# EasyEDA schematic schematic.easyeda.json
TITLE: Lunatic MIDI: Organ Registers/Pistons Hub interface; REV: 1.0; Date: 2019-05-01; Sheet: 1/1; Drawn By: Marco Sacchi
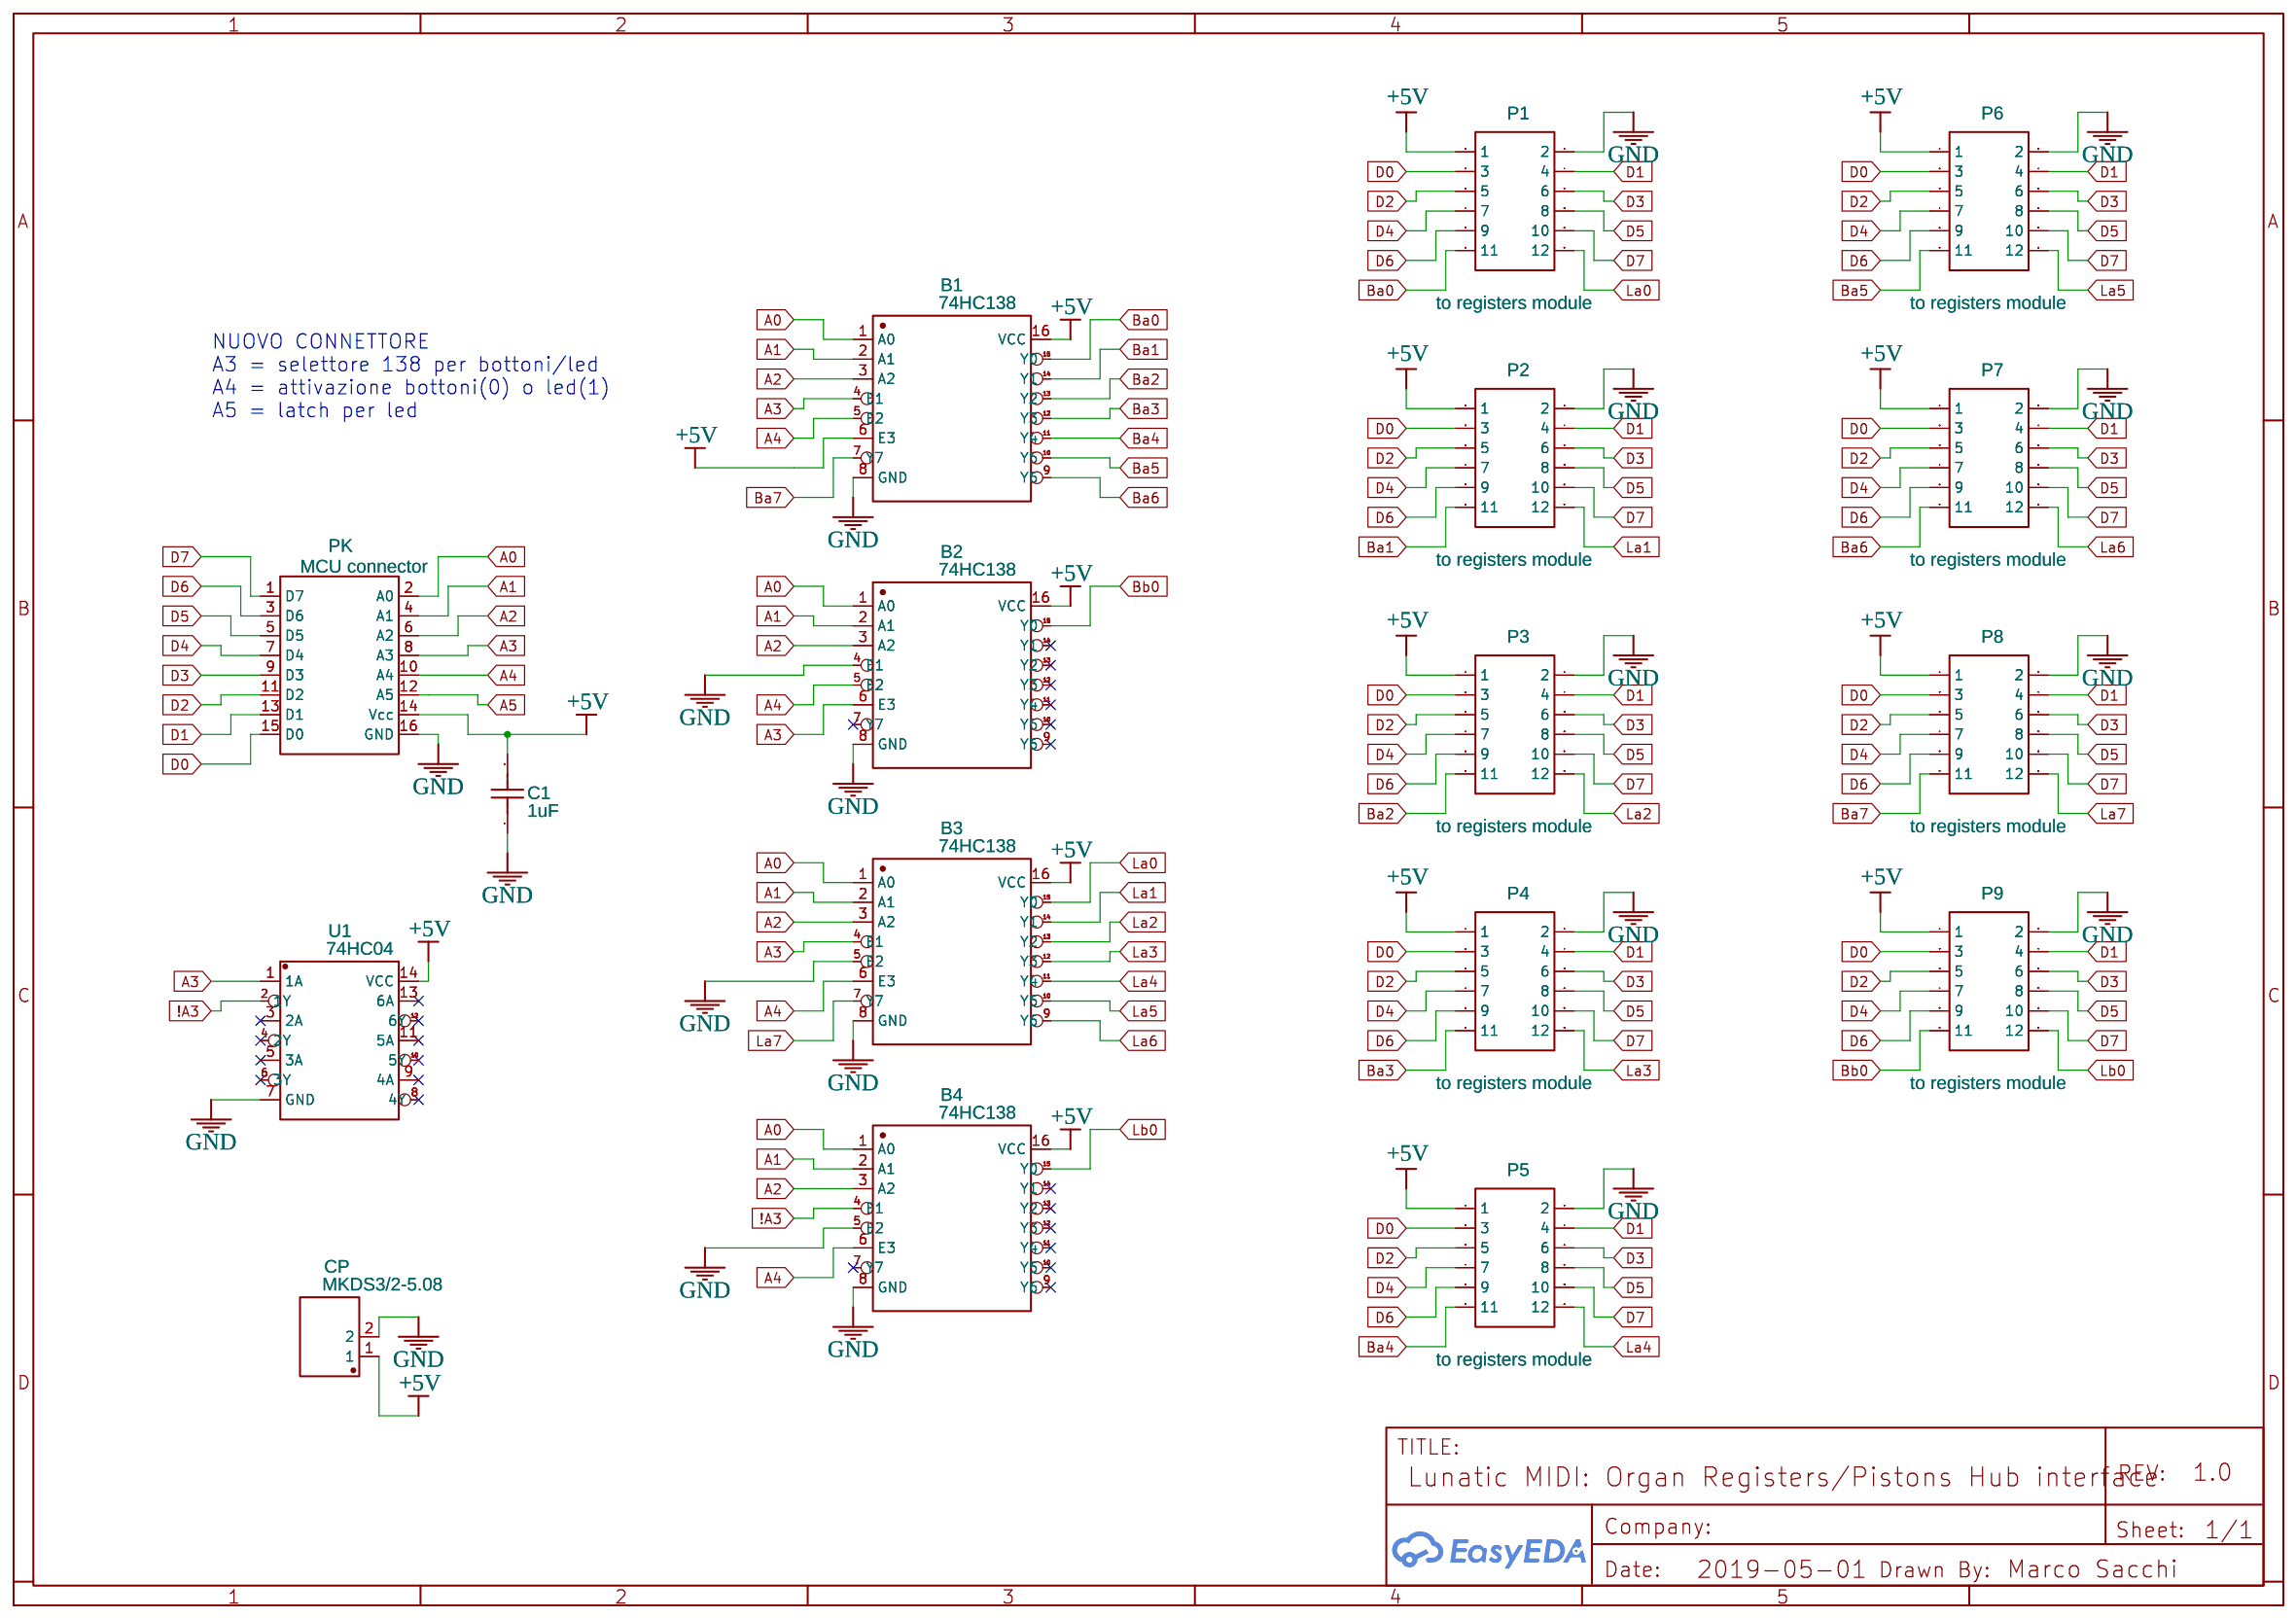
[diagram p0: schematic sheet]

## Parts
B1  74HC138  [DIP-16]
B2  74HC138  [DIP-16]
B3  74HC138  [DIP-16]
B4  74HC138  [DIP-16]
C1  1uF  [RAD-0.1]
CP  MKDS3/2-5.08  [MKDS3/2-5.08]
P1  to registers module  [HDR-6X2/2.54-BBOX]
P2  to registers module  [HDR-6X2/2.54-BBOX]
P3  to registers module  [HDR-6X2/2.54-BBOX]
P4  to registers module  [HDR-6X2/2.54-BBOX]
P5  to registers module  [HDR-6X2/2.54-BBOX]
P6  to registers module  [HDR-6X2/2.54-BBOX]
P7  to registers module  [HDR-6X2/2.54-BBOX]
P8  to registers module  [HDR-6X2/2.54-BBOX]
P9  to registers module  [HDR-6X2/2.54-BBOX]
PK  MCU connector  [HDR-8X2/2.54]
U1  74HC04  [DIP-14]

## Library data of the parts
B1-B4 = -: Manufacturer: STMicroelectronics; Supplier Part: C5194; Contributor: Lunatic electronics
C1 = Cap_RAD-0.1_US: Manufacturer Part: ?
CP = -: Supplier: LCSC; Manufacturer: Phoenix Contact; Supplier Part: C89120
P1-P9 = -: Supplier: LCSC; Supplier Part: C66689; Manufacturer Part: ?
PK = -: Manufacturer Part: GEM; image: //image.lceda.cn/szlcsc/C30734.jpg
U1 = -: Supplier Part: C192161; Manufacturer: Diodes Incorporated; Contributor: Lunatic electronics

## Nets
+5V: B1.6(E3) B1.16(VCC) B2.16(VCC) B3.16(VCC) B4.16(VCC) C1.2 CP.1 P1.1 P2.1 P3.1 P4.1 P5.1 P6.1 P7.1 P8.1 P9.1 PK.14(Vcc) U1.14(VCC)
GND: B1.8(GND) B2.4(E1) B2.8(GND) B3.5(E2) B3.8(GND) B4.5(E2) B4.8(GND) C1.1 CP.2 P1.2 P2.2 P3.2 P4.2 P5.2 P6.2 P7.2 P8.2 P9.2 PK.16(GND) U1.7(GND)
!A3: B4.4(E1) U1.2(1Y)
A0: B1.1(A0) B2.1(A0) B3.1(A0) B4.1(A0) PK.2(A0)
A1: B1.2(A1) B2.2(A1) B3.2(A1) B4.2(A1) PK.4(A1)
A2: B1.3(A2) B2.3(A2) B3.3(A2) B4.3(A2) PK.6(A2)
A3: B1.4(E1) B2.6(E3) B3.4(E1) PK.8(A3) U1.1(1A)
A4: B1.5(E2) B2.5(E2) B3.6(E3) B4.6(E3) PK.10(A4)
A5: PK.12(A5)
Ba0: B1.15(Y0) P1.11
Ba1: B1.14(Y1) P2.11
Ba2: B1.13(Y2) P3.11
Ba3: B1.12(Y3) P4.11
Ba4: B1.11(Y4) P5.11
Ba5: B1.10(Y5) P6.11
Ba6: B1.9(Y6) P7.11
Ba7: B1.7(Y7) P8.11
Bb0: B2.15(Y0) P9.11
D0: P1.3 P2.3 P3.3 P4.3 P5.3 P6.3 P7.3 P8.3 P9.3 PK.15(D0)
D1: P1.4 P2.4 P3.4 P4.4 P5.4 P6.4 P7.4 P8.4 P9.4 PK.13(D1)
D2: P1.5 P2.5 P3.5 P4.5 P5.5 P6.5 P7.5 P8.5 P9.5 PK.11(D2)
D3: P1.6 P2.6 P3.6 P4.6 P5.6 P6.6 P7.6 P8.6 P9.6 PK.9(D3)
D4: P1.7 P2.7 P3.7 P4.7 P5.7 P6.7 P7.7 P8.7 P9.7 PK.7(D4)
D5: P1.8 P2.8 P3.8 P4.8 P5.8 P6.8 P7.8 P8.8 P9.8 PK.5(D5)
D6: P1.9 P2.9 P3.9 P4.9 P5.9 P6.9 P7.9 P8.9 P9.9 PK.3(D6)
D7: P1.10 P2.10 P3.10 P4.10 P5.10 P6.10 P7.10 P8.10 P9.10 PK.1(D7)
La0: B3.15(Y0) P1.12
La1: B3.14(Y1) P2.12
La2: B3.13(Y2) P3.12
La3: B3.12(Y3) P4.12
La4: B3.11(Y4) P5.12
La5: B3.10(Y5) P6.12
La6: B3.9(Y6) P7.12
La7: B3.7(Y7) P8.12
Lb0: B4.15(Y0) P9.12

Not connected (* = marked no-connect by the designer): B2 7(Y7)* 9(Y6)* 10(Y5)* 11(Y4)* 12(Y3)* 13(Y2)* 14(Y1)*; B4 7(Y7)* 9(Y6)* 10(Y5)* 11(Y4)* 12(Y3)* 13(Y2)* 14(Y1)*; U1 3(2A)* 4(2Y)* 5(3A)* 6(3Y)* 8(4Y)* 9(4A)* 10(5Y)* 11(5A)* 12(6Y)* 13(6A)*

## Notes on the sheet
- NUOVO CONNETTORE
  A3 = selettore 138 per bottoni/led
  A4 = attivazione bottoni(0) o led(1)
  A5 = latch per led
